# Altium project VoiceCoil.PrjPcb
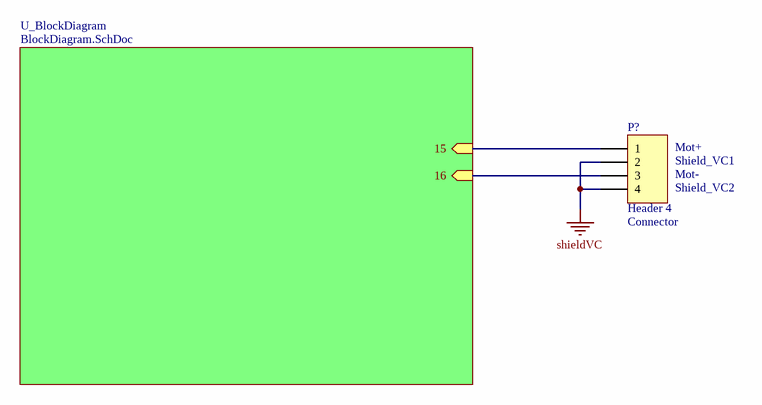
[diagram p0: VoiceCoil.SchDoc]
ProjectAuthor: BKO; ProjectiAiTitle: VoiceCoil; ProjectNumber: N° SGX; ProjectVersion: 1.0.0; ProjectVersionForDoc: 1_0_0
3 sheets, 1 parts. Net scope: hierarchical (ports join the sheet entries above them; power ports are global).
Board file: iAi_TemplateProject_4L.PcbDoc
Sheets:
  VoiceCoil.SchDoc
    U_BlockDiagram = BlockDiagram.SchDoc
  Block_VoiceCoil.SchDoc

## Sheet VoiceCoil.SchDoc: <title>
size A4; Author: BKO; Organization: Institut d'Automatisation Industrielle; SheetNumber: 1; SheetTotal: 2; SVN: OUI; Version: 1.0.0; NoProject: N° SGX; ProjectTitle: VoiceCoil; CurrentTime: 6; CurrentDate: 5; DocumentFullPathAndName: 8; DocumentName: 9; ModifiedDate: 13; ProjectName: <projet>

### Parts
P?  Header 4  System: Connector  [HDR1X4]

### Sub-sheets
U_BlockDiagram = BlockDiagram.SchDoc: 15 (in), 16 (in)

### Nets
shieldVC: P?.2 P?.4
NetP?_1: P?.1 ; sheet U_BlockDiagram/15
NetP?_3: P?.3 ; sheet U_BlockDiagram/16

### Notes on the sheet
- (near P?) Mot+
- (near P?) Shield_VC1
- (near P?) Mot-
- (near P?) Shield_VC2
- Title
- Institut d'automatisation industrielle
  rte de Cheseaux 1
  CH-1401 Yverdon-les-Bains
  T +41(0)24 55 77 377    F +41(0)24 55 76 320
  http://iai.heig-vd.ch       iai@heig-vd.ch
- Date:
- Size:
- A4
- Project:
- Sheet
- of
- No.
- Author:
- SVN
- Version
- File:

### Library data of the parts
P? = Header 4: Header, 4-Pin; LatestRevisionDate: 17-Jul-2002; LatestRevisionNote: Re-released for DXP Platform.; Publisher: Altium Limited

## Sheet BlockDiagram.SchDoc: <title>
size A4; Author: BKO; Organization: Institut d'Automatisation Industrielle; SheetNumber: 2; SheetTotal: 2; SVN: OUI; Version: 1.0.0; NoProject: N° SGX; ProjectTitle: VoiceCoil; CurrentTime: 6; CurrentDate: 5; DocumentFullPathAndName: 8; DocumentName: 9; ModifiedDate: 13; ProjectName: <projet>

### Notes on the sheet
- Title
- Institut d'automatisation industrielle
  rte de Cheseaux 1
  CH-1401 Yverdon-les-Bains
  T +41(0)24 55 77 377    F +41(0)24 55 76 320
  http://iai.heig-vd.ch       iai@heig-vd.ch
- Date:
- Size:
- A4
- Project:
- Sheet
- of
- No.
- Author:
- SVN
- Version
- File:

## Sheet Block_VoiceCoil.SchDoc: <title>
size A4; Author: BKO; Organization: Institut d'Automatisation Industrielle; SheetNumber: 3; SheetTotal: 3; SVN: OUI; Version: 1.0.0; NoProject: N° SGX; ProjectTitle: VoiceCoil; CurrentTime: 6; CurrentDate: 5; DocumentFullPathAndName: 8; DocumentName: 9; ModifiedDate: 13; ProjectName: <projet>

### Notes on the sheet
- Title
- Institut d'automatisation industrielle
  rte de Cheseaux 1
  CH-1401 Yverdon-les-Bains
  T +41(0)24 55 77 377    F +41(0)24 55 76 320
  http://iai.heig-vd.ch       iai@heig-vd.ch
- Date:
- Size:
- A4
- Project:
- Sheet
- of
- No.
- Author:
- SVN
- Version
- File: